# Altium schematic sheet Power.SchDoc
size A
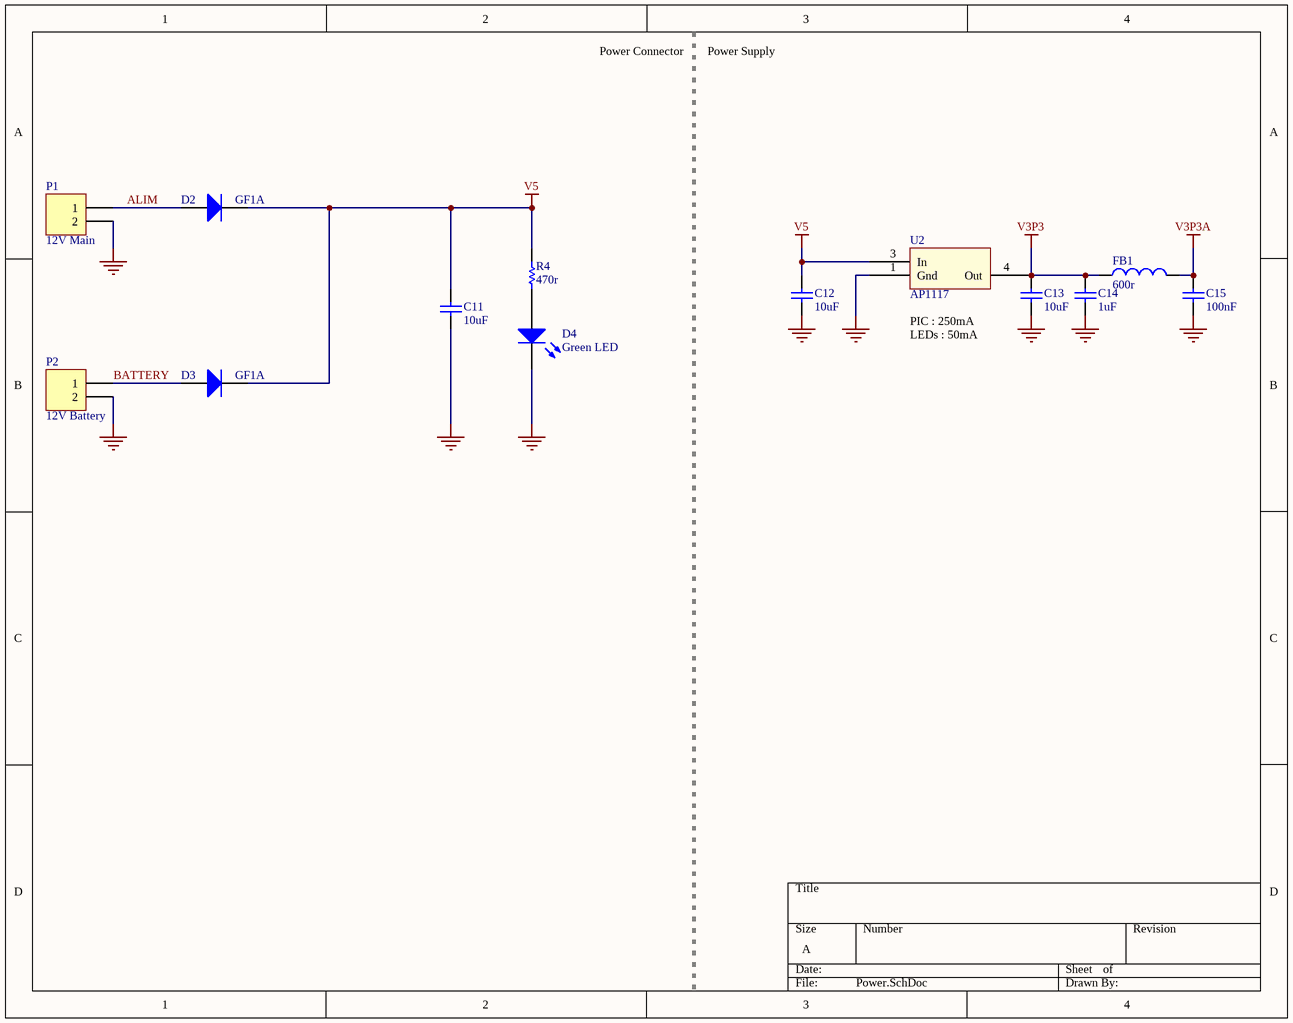
[diagram p0: Power.SchDoc]

## Parts
C11  10uF  [CAPC2012N]
C12  10uF  [CAPC2012N]
C13  10uF  [CAPC2012N]
C14  1uF  [CAPC1608N]
C15  100nF  [CAPC1608N]
D2  GF1A  [214AC_21]
D3  GF1A  [214AC_21]
D4  Green LED  [LED 0805]
FB1  600r  [INDC1608AN]
P1  12V Main  [PHOENIX_1985195]
P2  12V Battery  [PHOENIX_1985195]
R4  470r  [RESC1608N]
U2  AP1117  [TD03B_N]

## Nets
GND: C11.1 C12.1 C13.1 C14.1 C15.1 D4.2(K) P1.2 P2.2 U2.1(Gnd)
V3P3: C13.2 C14.2 FB1.1 U2.4(Out)
V3P3A: C15.2 FB1.2
V5: C11.2 C12.2 D2.2(K) D3.2(K) R4.2 U2.3(In)
ALIM: D2.1(A) P1.1
BATTERY: D3.1(A) P2.1
NetD4_1: D4.1(A) R4.1

## Notes on the sheet
- Power Connector
- Power Supply
- PIC : 250mA
- LEDs : 50mA

## Library data of the parts
C11-C13 = Cap: Capacitor; Fabricant: TDK; Ref.Fabricant: C2012X5R0J106M/1.25; Fournisseur: Farnell; Ref.Fournisseur: 2309029; Precision: 6.3V X5R 10uF; Valeur: 10uF
C14 = Cap: Capacitor; Precision: 6.3V X5R; Valeur: 1uF
C15 = Cap: Capacitor; Precision: 50V X5R; Valeur: 100nF
D2 D3 = Diode: Default Diode; Fournisseur: Farnell; Fabricant: VISHAY; Ref.Fournisseur: 9549560; Ref.Fabricant: 6FIA-E3/67A
D4 = LED0: Typical INFRARED GaAs LED; Fournisseur: Farnell; Fabricant: KING BRIGHT; Ref.Fournisseur: 2099239; Ref.Fabricant: KPT-2012SGC
FB1 = Inductor: Ref.Fabricant: 472792651; Ref.Fournisseur: 1635706; Fabricant: WURTH; Fournisseur: Farnell; Valeur: 600r
P1 = Header 2: Header, 2-Pin; Fabricant: PHOENIX CONTACT; Ref.Fabricant: PTSA 1.5/2-3,5-Z; Fournisseur: Farnell; Ref.Fournisseur: 1792769
P2 = Header 2: Header, 2-Pin; Ref.Fournisseur: 1792769; Fournisseur: Farnell; Ref.Fabricant: PTSA 1.5/2-3,5-Z; Fabricant: PHOENIX CONTACT
R4 = Res1: Resistor; Valeur: 4.7k; Precision: 1%
U2 = AP1117: Fabricant: DIODES INC; Fournisseur: Farnell; Ref.Fabricant: AP1117D33G-13; Ref.Fournisseur: 1825285